# EAGLE design PS (EAGLE 6.2)
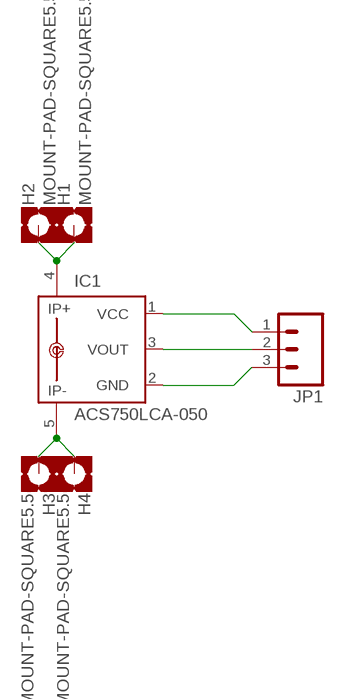
[diagram p0: schematic, sheet 1]

## Parts
H1  MOUNT-PAD-SQUARE5.5  [5,5-PAD-SQUARE]
H2  MOUNT-PAD-SQUARE5.5  [5,5-PAD-SQUARE]
H3  MOUNT-PAD-SQUARE5.5  [5,5-PAD-SQUARE]
H4  MOUNT-PAD-SQUARE5.5  [5,5-PAD-SQUARE]
IC1  ACS750LCA-050  [ACS75050]
JP1  M03POLAR_LOCK  [MOLEX-1X3_LOCK]

## Nets
N$1: IC1.1(VCC) JP1.1
N$2: IC1.3(VOUT) JP1.2
N$3: IC1.2(GND) JP1.3
N$4: H3.B5,5(MOUNT) H4.B5,5(MOUNT) IC1.5(IP-)
N$5: H1.B5,5(MOUNT) H2.B5,5(MOUNT) IC1.4(IP+)
Unconnected: IC1.IP+1 IC1.IP-1

## Library data of the parts
H1-H4 = holes:MOUNT-PAD-SQUARE: MOUNTING PAD, square
IC1 = allegro:ACS750*CA-050: Current Sensor display layer 49 Reference in BRD and place VIAs on circles Source: www.allegromicro.com/datafile/0750-050.pdf; MF: ALLEGRO MICROSYSTEMS, INC.; MPN: ACS750LCA-050; OC_FARNELL: 1457176; OC_NEWARK: 61H4464
JP1 = SparkFun:M03: Header 3 Standard 3-pin 0.1" header. Use with straight break away headers (SKU : PRT-00116), right angle break away headers (PRT-00553), swiss pins (PRT-00743), machine pins (PRT-00117), and female headers (PRT-00115). Molex polarized connector foot print use with SKU : PRT-08232 with associated crimp pins and housings.

## Board
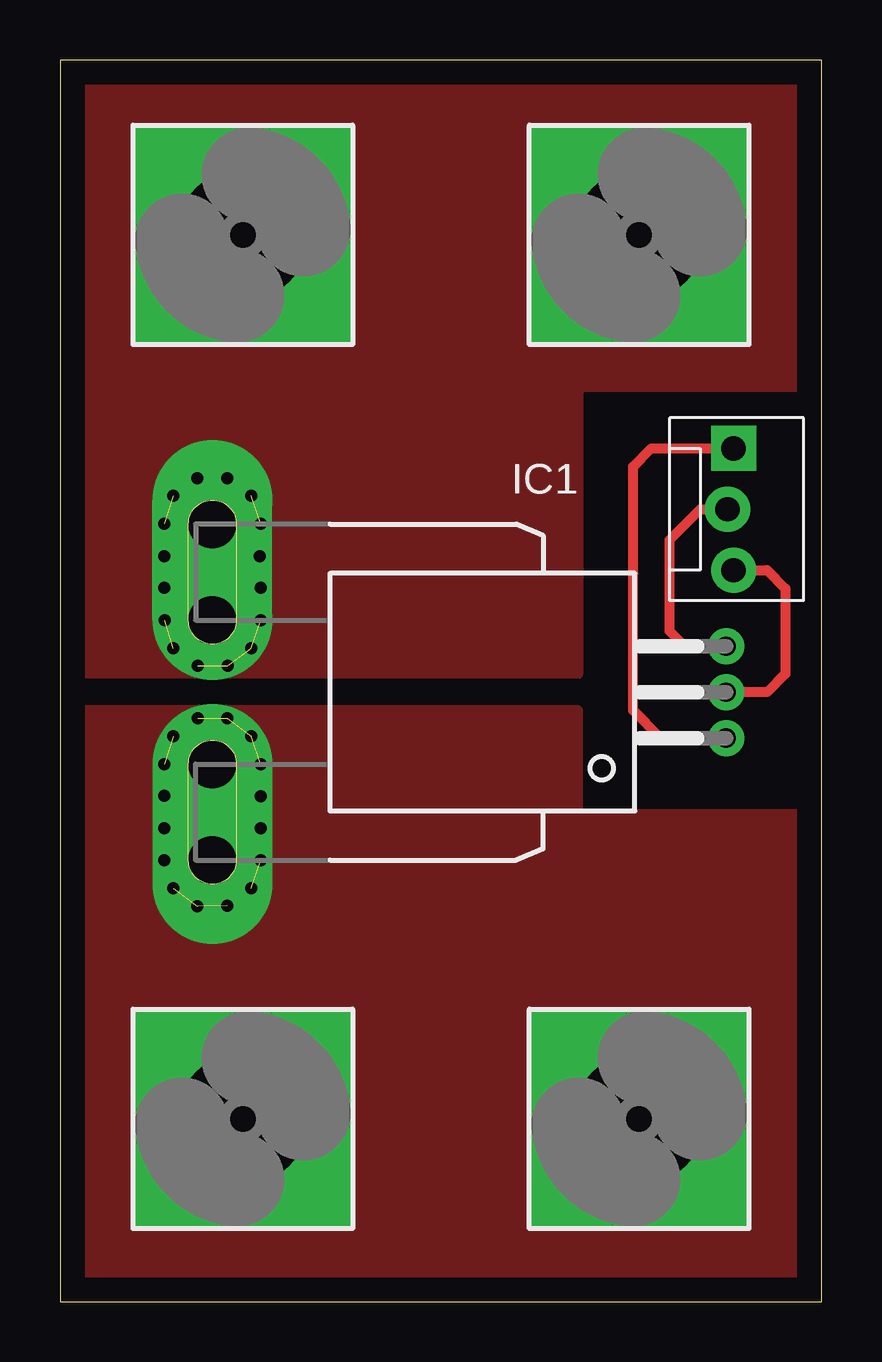
[diagram p1: board, top side]
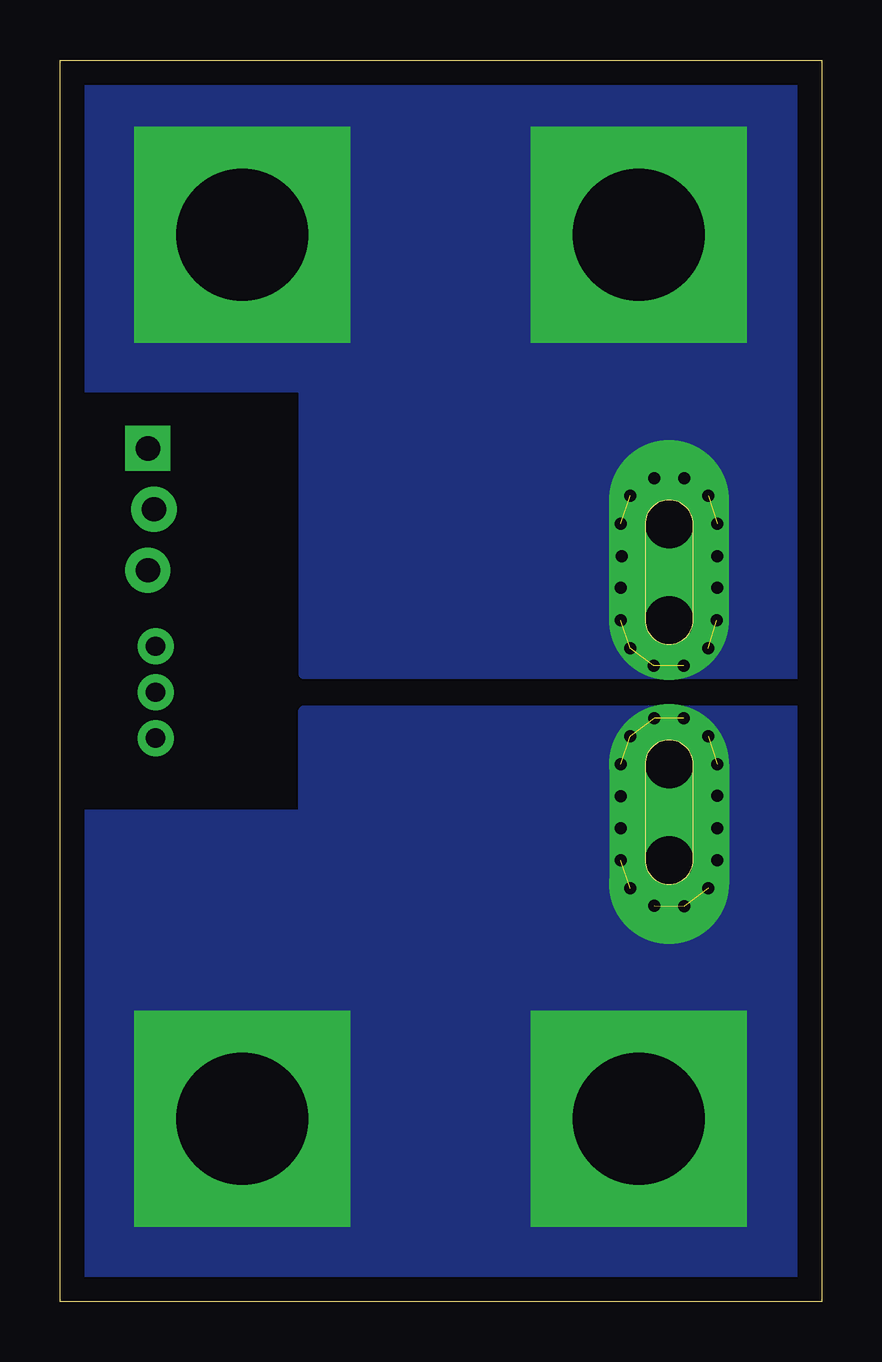
[diagram p2: board, bottom side, seen from below]

Size 31.73 x 51.74 mm. Coordinates in mm from the lower left corner, seen from the top.
Outline: 0,0 31.73,0 31.73,51.74 0,51.74 0,0
Copper layers (1*16): Top 0.035mm / dielectric 1.5mm / Bottom 0.035mm
Design rules: minimum track width 10mil, minimum drill 24mil, track to track 8mil, track to pad 8mil, pad to pad 8mil, via to via 8mil, smd to smd 8mil, copper to edge 40mil, drill to drill 8mil, minimum pad ring 10mil, minimum via ring 8mil, stop-mask expansion 4mil, vias tented up to drill 0mil, thermal gap 10mil

### Footprints (pad centres in the part's own frame; a part is rotated, then mirrored left to right if it is on the bottom)
5,5-PAD-SQUARE = drill 5.5 pad 9 square: B5,5 0,0
ACS75050 = drill 0.8 pad 1.5: 1 -1.91,-21.4; 2 0,-21.4; 3 1.91,-21.4 | drill 2 pad 5 offset: 4 3,0; 5 -3,0 | drill 2 pad 4 offset: IP+1 7,0; IP-1 -7,0
MOLEX-1X3_LOCK = drill 1.016 pad 1.88 square: 1 0,0.127 | drill 1.016 pad 1.88: 2 2.54,-0.127; 3 5.08,0.127

### Placement (x,y rotation side)
H1  7.62,44.45 0 top
H2  24.13,44.45 0 top
H3  7.62,7.62 0 top
H4  24.13,7.62 0 top
IC1  6.35,25.4 90 top
JP1  27.94,35.56 270 top

### Tracks (layer width: path | path; a pad name or v marks a point on that pad's centre or on a via)
N$1
  Top 0.406: IC1.1 25.02,23.49 23.88,24.64 23.88,34.8 24.64,35.56 JP1.1
N$2
  Top 0.406: IC1.3 26.03,27.31 25.4,27.94 25.4,31.75 26.67,33.02 JP1.2
N$3
  Top 0.406: JP1.3 29.46,30.48 30.23,29.72 30.23,26.16 29.46,25.4 IC1.2
N$4  (via drill 0.5)  (7 unrouted)
  other vias: 4.34,21.08 4.34,19.74 4.34,18.39 4.72,17.22 5.71,16.48 6.96,16.51 7.98,17.22 8.36,18.39 8.36,19.74 8.36,21.06 8.36,22.4 7.98,23.57 6.96,24.31 5.74,24.31 4.72,23.57 4.34,22.4
  pour Top (no thermals): 0,0 31.75,0 31.75,20.32 21.59,20.32 21.59,24.64 0,24.64
  pour Bottom (no thermals): 0,0 31.75,0 31.75,20.32 21.59,20.32 21.59,24.64 0,24.64
N$5  (via drill 0.5)  (6 unrouted)
  other vias: 4.34,31.06 4.34,29.74 4.37,28.4 4.72,27.23 5.74,26.49 6.99,26.49 7.98,27.23 8.36,28.4 8.36,29.74 8.33,31.06 8.36,32.41 7.98,33.58 6.96,34.32 5.71,34.32 4.72,33.58 4.34,32.41
  pour Top (no thermals): 0,52.07 31.75,52.07 31.75,38.1 21.59,38.1 21.59,26.16 0,26.16
  pour Bottom (no thermals): 0,51.82 31.75,51.82 31.75,38.1 21.59,38.1 21.59,26.16 0,26.16